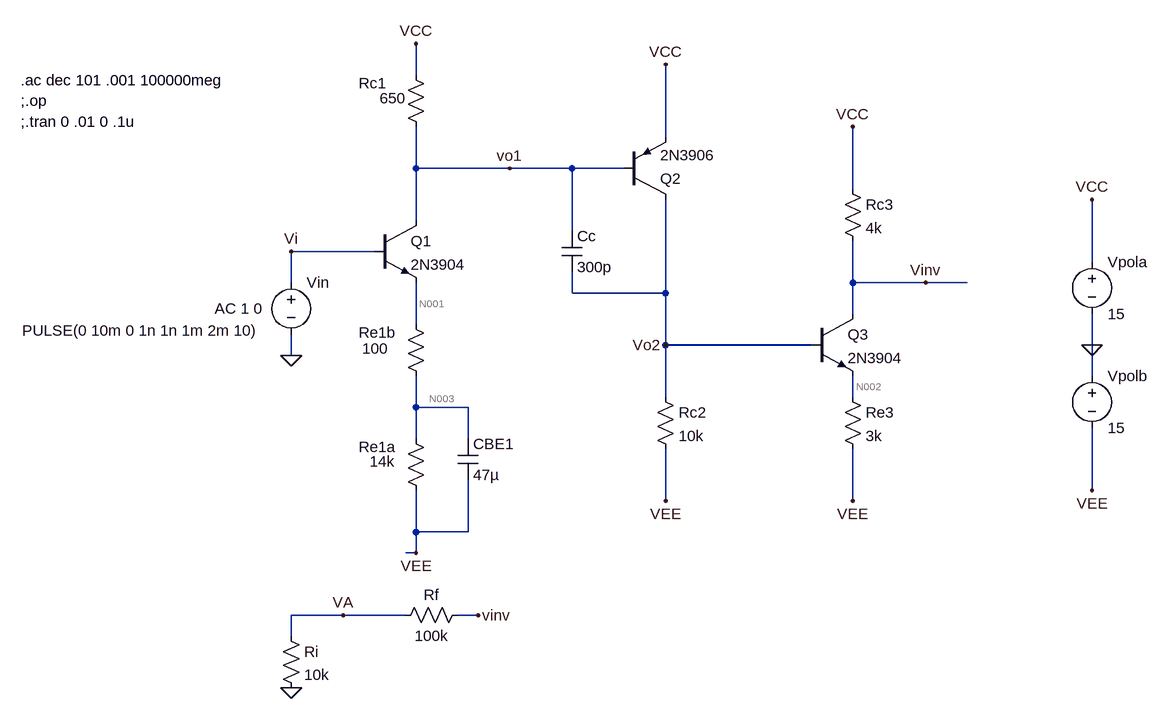
[diagram p0: schematic laboE3.asc]
laboE3.asc, the LTspice schematic file:
Version 4
SHEET 1 3532 2244
WIRE 400 -144 400 -192
WIRE 784 -48 784 -160
WIRE 400 0 400 -64
WIRE 544 0 400 0
WIRE 640 0 544 0
WIRE 720 0 640 0
WIRE 1072 32 1072 -64
WIRE 400 80 400 0
WIRE 640 96 640 0
WIRE 336 128 208 128
WIRE 1440 144 1440 48
WIRE 208 176 208 128
WIRE 1072 176 1072 112
WIRE 1184 176 1072 176
WIRE 1248 176 1184 176
WIRE 640 192 640 160
WIRE 784 192 784 48
WIRE 784 192 640 192
WIRE 1072 224 1072 176
WIRE 400 240 400 176
WIRE 784 272 784 192
WIRE 1008 272 784 272
WIRE 1440 272 1440 224
WIRE 208 288 208 256
WIRE 1440 320 1440 272
WIRE 784 352 784 272
WIRE 1072 352 1072 320
WIRE 400 368 400 320
WIRE 480 368 400 368
WIRE 400 416 400 368
WIRE 480 416 480 368
WIRE 1440 496 1440 400
WIRE 784 512 784 432
WIRE 1072 512 1072 432
WIRE 400 560 400 496
WIRE 480 560 480 480
WIRE 480 560 400 560
WIRE 400 592 400 560
WIRE 400 592 384 592
WIRE 288 688 208 688
WIRE 384 688 288 688
WIRE 496 688 464 688
WIRE 208 720 208 688
FLAG 1440 48 VCC
FLAG 1440 496 VEE
FLAG 1440 272 0
FLAG 784 -160 VCC
FLAG 784 512 VEE
FLAG 784 272 Vo2
FLAG 400 -192 VCC
FLAG 400 592 VEE
FLAG 544 0 vo1
FLAG 208 800 0
FLAG 208 128 Vi
FLAG 288 688 VA
FLAG 1072 -64 VCC
FLAG 1072 512 VEE
FLAG 1184 176 Vinv
FLAG 496 688 vinv
FLAG 208 288 0
SYMBOL voltage 208 160 R0
WINDOW 123 -118 56 Left 2
WINDOW 39 0 0 Left 0
WINDOW 3 -414 90 Left 2
SYMATTR Value2 AC 1 0
SYMATTR Value PULSE(0 10m 0 1n 1n 1m 2m 10)
SYMATTR InstName Vin
SYMBOL voltage 1440 128 R0
WINDOW 123 0 0 Left 0
WINDOW 39 0 0 Left 0
SYMATTR InstName Vpola
SYMATTR Value 15
SYMBOL voltage 1440 304 R0
WINDOW 123 0 0 Left 0
WINDOW 39 0 0 Left 0
SYMATTR InstName Vpolb
SYMATTR Value 15
SYMBOL pnp 720 48 M180
SYMATTR InstName Q2
SYMATTR Value 2N3906
SYMBOL res 768 336 R0
SYMATTR InstName Rc2
SYMATTR Value 10k
SYMBOL npn 336 80 R0
SYMATTR InstName Q1
SYMATTR Value 2N3904
SYMBOL res 384 -160 R0
WINDOW 0 -72 29 Left 2
WINDOW 3 -40 52 Left 2
SYMATTR InstName Rc1
SYMATTR Value 650
SYMBOL res 384 400 R0
WINDOW 0 -72 29 Left 2
WINDOW 3 -55 51 Left 2
SYMATTR InstName Re1a
SYMATTR Value 14k
SYMBOL res 384 224 R0
WINDOW 0 -72 29 Left 2
WINDOW 3 -67 53 Left 2
SYMATTR InstName Re1b
SYMATTR Value 100
SYMBOL cap 464 416 R0
SYMATTR InstName CBE1
SYMATTR Value 47µ
SYMBOL cap 624 96 R0
SYMATTR InstName Cc
SYMATTR Value 300p
SYMBOL res 192 704 R0
SYMATTR InstName Ri
SYMATTR Value 10k
SYMBOL res 480 672 R90
WINDOW 0 0 56 VBottom 2
WINDOW 3 32 56 VTop 2
SYMATTR InstName Rf
SYMATTR Value 100k
SYMBOL npn 1008 224 R0
SYMATTR InstName Q3
SYMATTR Value 2N3904
SYMBOL res 1056 336 R0
SYMATTR InstName Re3
SYMATTR Value 3k
SYMBOL res 1056 16 R0
SYMATTR InstName Rc3
SYMATTR Value 4k
TEXT -208 -104 Left 2 !;.op
TEXT -208 -136 Left 2 !.ac dec 101 .001 100000meg
TEXT -208 -72 Left 2 !;.tran 0 .01 0 .1u

The netlist it stands for:
* laboE3.asc
Vin Vi 0 PULSE(0 10m 0 1n 1n 1m 2m 10) AC 1 0
Vpola VCC 0 15
Vpolb 0 VEE 15
Q2 Vo2 vo1 VCC 0 2N3906
Rc2 Vo2 VEE 10k
Q1 vo1 Vi N001 0 2N3904
Rc1 VCC vo1 650
Re1a N003 VEE 14k
Re1b N001 N003 100
CBE1 N003 VEE 47µ
Cc vo1 Vo2 300p
Ri VA 0 10k
Rf Vinv VA 100k
Q3 Vinv Vo2 N002 0 2N3904
Re3 N002 VEE 3k
Rc3 VCC Vinv 4k
.model NPN NPN
.model PNP PNP
.lib standard.bjt
;.op
.ac dec 101 .001 100000meg
;.tran 0 .01 0 .1u
.backanno
.end

* Results of the author's LTspice run, read from the files saved beside the schematic
* Operating Point, zero values left out:
*   V(vcc) = 15 V
*   V(vee) = -15 V
*   V(vo2) = -3.046 V
*   V(vo1) = 14.34 V
*   V(n001) = -652.2 mV
*   V(n003) = -754 mV
*   V(va) = 2.546 mV
*   V(vinv) = 28.01 mV
*   V(n002) = -3.735 V
*   Ic(Q2) = -1.208 mA
*   Ib(Q2) = -5.157 µA
*   Ie(Q2) = 1.213 mA
*   Ic(Q1) = 1.015 mA
*   Ib(Q1) = 2.964 µA
*   Ie(Q1) = -1.018 mA
*   Ic(Q3) = 3.743 mA
*   Ib(Q3) = 12.21 µA
*   Ie(Q3) = -3.755 mA
*   I(Rc2) = 1.195 mA
*   I(Rc1) = 1.009 mA
*   I(Re1a) = 1.018 mA
*   I(Re1b) = 1.018 mA
*   I(Ri) = 254.6 nA
*   I(Rf) = 254.6 nA
*   I(Re3) = 3.755 mA
*   I(Rc3) = 3.743 mA
*   I(Vin) = -2.964 µA
*   I(Vpola) = -5.965 mA
*   I(Vpolb) = -5.968 mA
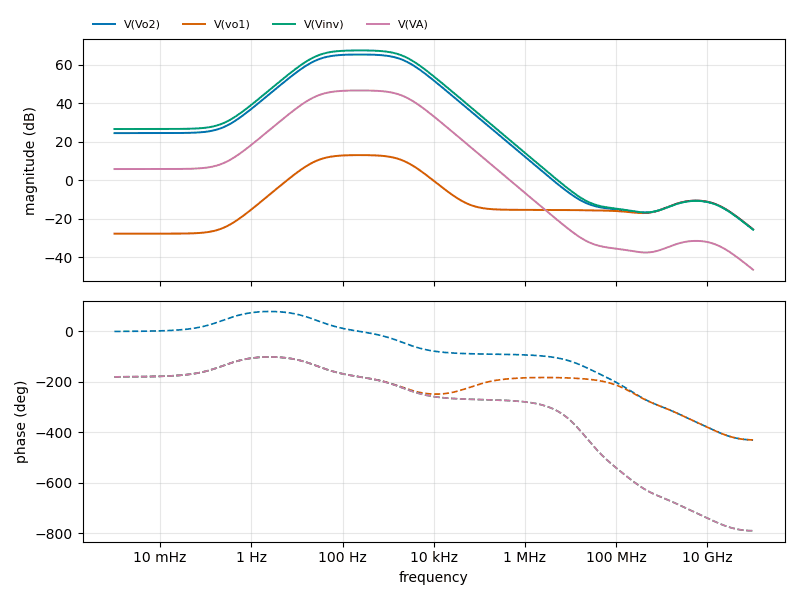
[diagram p1: AC Analysis of laboE3.asc, plotted from the saved traces]
* AC Analysis, 1 run:
*   V(Vo2): 24.51 dB at 1 mHz, -25.62 dB at 100 GHz, peak 65.41 dB at 243.3 Hz, 3 dB below the peak at 26.5 Hz and 2.184 kHz
*   V(vo1): -27.82 dB at 1 mHz, -25.57 dB at 100 GHz, peak 13.08 dB at 243.3 Hz, 3 dB below the peak at 26.5 Hz and 2.187 kHz
*   V(Vinv): 26.64 dB at 1 mHz, -25.72 dB at 100 GHz, peak 67.54 dB at 243.3 Hz, 3 dB below the peak at 26.5 Hz and 2.184 kHz
*   V(VA): 5.81 dB at 1 mHz, -46.55 dB at 100 GHz, peak 46.71 dB at 243.3 Hz, 3 dB below the peak at 26.5 Hz and 2.184 kHz